# EAGLE design Zerow (EAGLE 9.1.3)

## Sheet 1 of 2

## Sheet 2 of 2
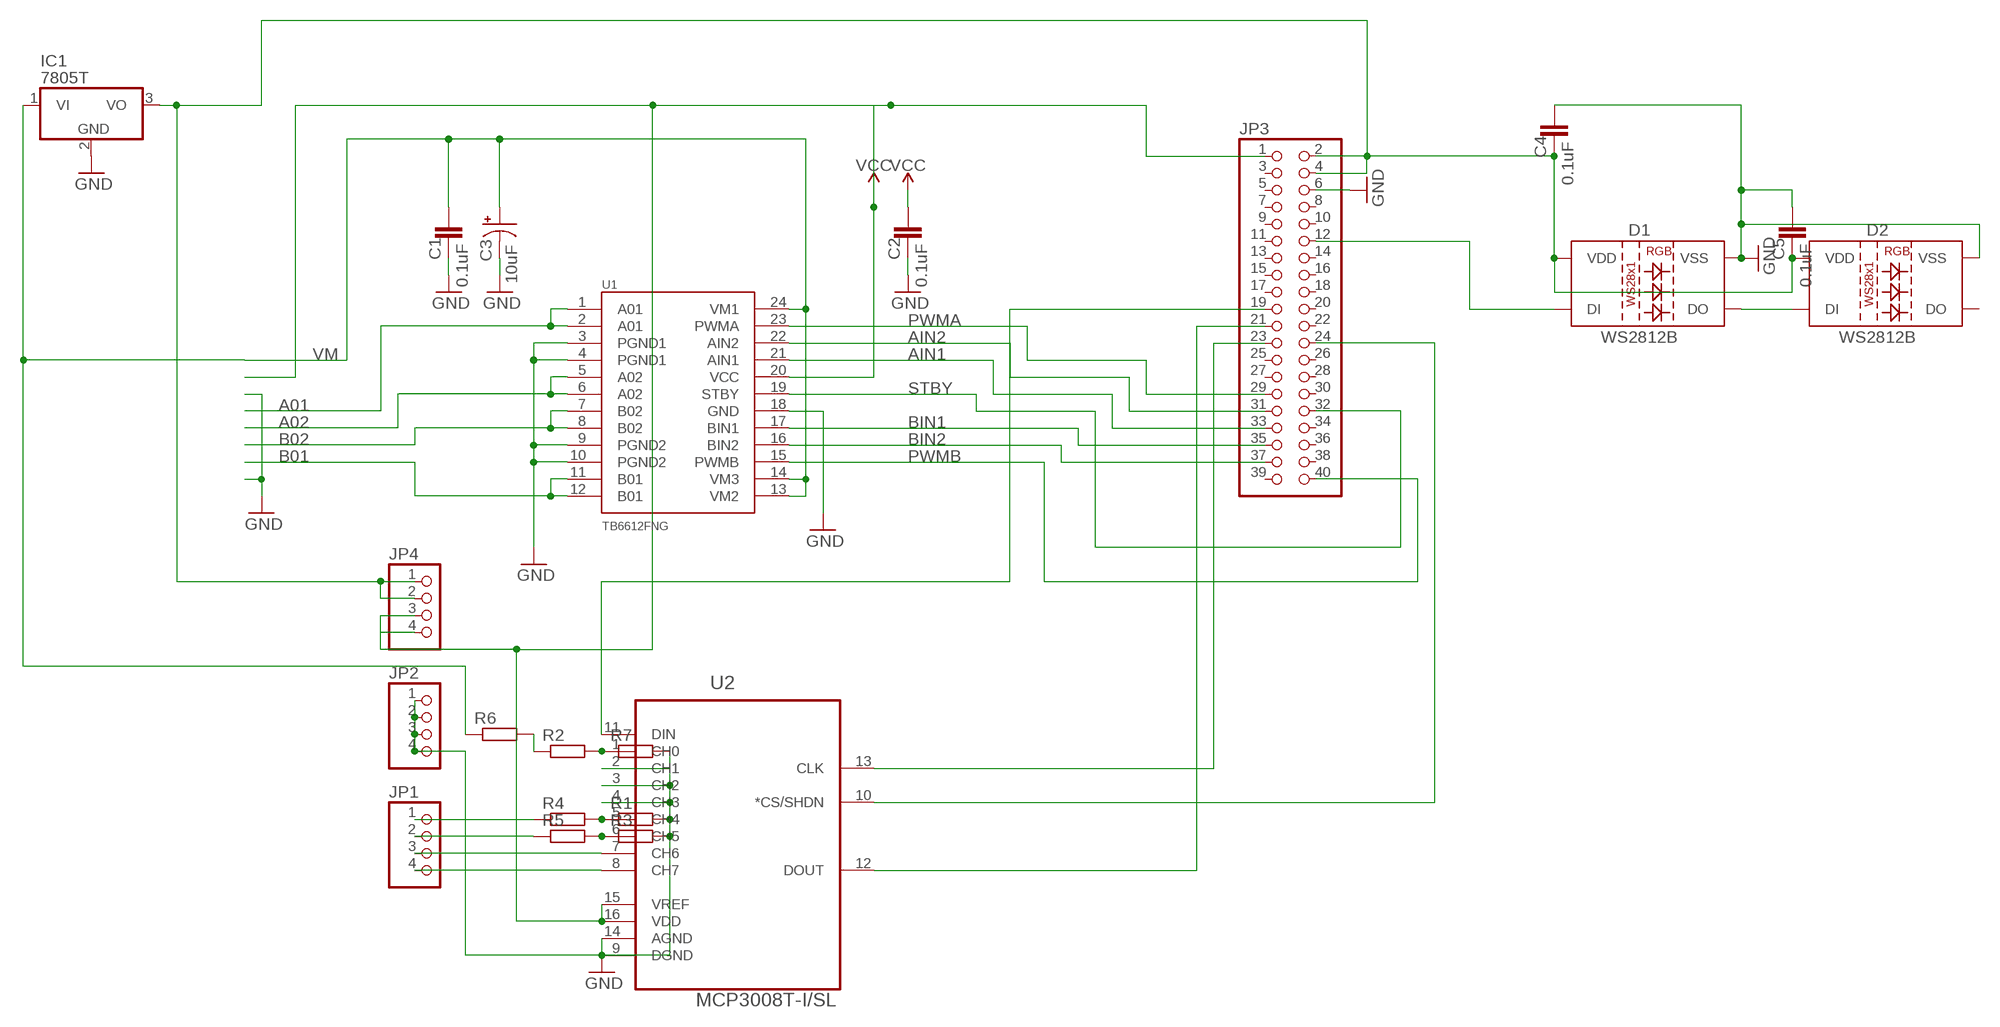
[diagram p0: schematic, sheet 2]

### Parts
C1  0.1uF  0.1UF-0402-16V-10%  [0402]
C2  0.1uF  0.1UF-0402-16V-10%  [0402]
C3  10uF  10UF-POLAR-EIA3528-20V-10%(TANT)  [EIA3528]
C4  0.1uF  0.1UF-0402-16V-10%  [0402]
C5  0.1uF  0.1UF-0402-16V-10%  [0402]
D1  WS2812B  [WS2812B]
D2  WS2812B  [WS2812B]
IC1  7805T  [TO220H]
JP1  PINHD-1X4  [1X04]
JP2  PINHD-1X4  [1X04]
JP3  PINHD-2X20  [2X20]
JP4  PINHD-1X4  [1X04]
R1  R-EU_R0805  [R0805]
R2  R-EU_R0805  [R0805]
R3  R-EU_R0805  [R0805]
R4  R-EU_R0805  [R0805]
R5  R-EU_R0805  [R0805]
R6  R-EU_R0805  [R0805]
R7  R-EU_R0805  [R0805]
U1  TB6612FNG  [SSOP24]
U2  MCP3008T-I/SL  [SOIC127P600X175-16N]

### Nets
5V: C4.2 C5.2 D1.1(VDD) D2.1(VDD) IC1.3(VO) JP3.2 JP3.4 JP4.1 JP4.2
A01: U1.1(A01) U1.2(A01)
A02: U1.5(A02) U1.6(A02)
AIN1: JP3.33 U1.21(AIN1)
AIN2: JP3.31 U1.22(AIN2)
B01: U1.11(B01) U1.12(B01)
B02: U1.7(B02) U1.8(B02)
BIN1: JP3.35 U1.17(BIN1)
BIN2: JP3.37 U1.16(BIN2)
GND: C1.2 C2.2 C3.C(-) C4.1 C5.1 D1.3(VSS) D2.3(VSS) IC1.2(GND) JP2.1 JP2.2 JP2.3 JP2.4 JP3.6 R1.2 R3.2 R7.2 U1.3(PGND1) U1.4(PGND1) U1.9(PGND2) U1.10(PGND2) U1.18(GND) U2.2(CH1) U2.3(CH2) U2.4(CH3) U2.9(DGND) U2.14(AGND)
N$3: JP3.23 U2.13(CLK)
N$4: JP3.19 U2.11(DIN)
N$5: JP3.21 U2.12(DOUT)
N$6: JP3.24 U2.10(*CS/SHDN)
N$7: JP1.4 U2.8(CH7)
N$8: JP1.3 U2.7(CH6)
N$9: R1.1 R4.2 U2.5(CH4)
N$10: R3.1 R5.2 U2.6(CH5)
N$11: JP1.1 R4.1
N$13: JP1.2 R5.1
N$14: R2.2 R7.1 U2.1(CH0)
N$15: R2.1 R6.2
N$17: D1.4(DI) JP3.12
N$18: D1.2(DO) D2.4(DI)
PWMA: JP3.29 U1.23(PWMA)
PWMB: JP3.40 U1.15(PWMB)
STBY: JP3.32 U1.19(STBY)
VCC: C2.1 JP3.1 JP4.3 JP4.4 U1.20(VCC) U2.15(VREF) U2.16(VDD)
VM: C1.1 C3.A(+) IC1.1(VI) R6.1 U1.13(VM2) U1.14(VM3) U1.24(VM1)
Unconnected: D2.2(DO) JP3.3 JP3.5 JP3.7 JP3.8 JP3.9 JP3.10 JP3.11 JP3.13 JP3.14 JP3.15 JP3.16 JP3.17 JP3.18 JP3.20 JP3.22 JP3.25 JP3.26 JP3.27 JP3.28 JP3.30 JP3.34 JP3.36 JP3.38 JP3.39

## Library data of the parts
C1 C2 C4 C5 = SparkFun-Capacitors:0.1UF: 0.1µF ceramic capacitors A capacitor is a passive two-terminal electrical component used to store electrical energy temporarily in an electric field.; PROD_ID: CAP-12416
C3 = SparkFun-Capacitors:10UF-POLAR: 10.0µF polarized capacitors A capacitor is a passive two-terminal electrical component used to store electrical energy temporarily in an electric field.; PROD_ID: CAP-08063
D1 D2 = SparkFun-LED:WS2812B: WS2812B SMD addressable RGB LED 5x5mm SMD LED with built-in controller IC. Color: Red/Green/Blue mC Rating: RGB: 390, 660, 180 mcd Forward Voltage: RGB: 2.0, 3.0, 3.0 V Packages:WS2812B SparkFun Products: Blynk Board - ESP8266 <https://www.sparkfun.com/products/13794>; PROD_ID: DIO-12503
IC1 = linear:78*: Positive VOLTAGE REGULATOR Source: http://cache.national.com/ds/LM/LM78L05.pdf http://www.fairchildsemi.com/ds/LM/LM7805.pdf
JP1 JP2 JP4 = pinhead:PINHD-1X4: PIN HEADER
JP3 = pinhead:PINHD-2X20: PIN HEADER
R1-R7 = resistor:R-EU_: RESISTOR, European symbol
U1 = SparkFun-IC-Special-Function:TB6612FNG: Toshiba 1A dual motor driver IC-09363; PROD_ID: IC-09363
U2 = MCP3008T-I_SL:MCP3008T-I/SL: 10BIT ADC, 8 CH, SPI, SMD; DESCRIPTION: Eight Channel SPI Serial Interface 2.7 V 10-Bit A/D Converter SMT - SOIC-16; DIGI-KEY_PART_NUMBER: MCP3008T-I/SLCT-ND; DIGI-KEY_PURCHASE_URL: https://www.digikey.com/product-detail/en/microchip-technology/MCP3008T-I-SL/MCP3008T-I-SLCT-ND/5148847?utm_source=snapeda&utm_medium=aggregator&utm_campaign=symbol; MF: Microchip; MP: MCP3008T-I/SL; PACKAGE: SOIC-16 Microchip

## Board
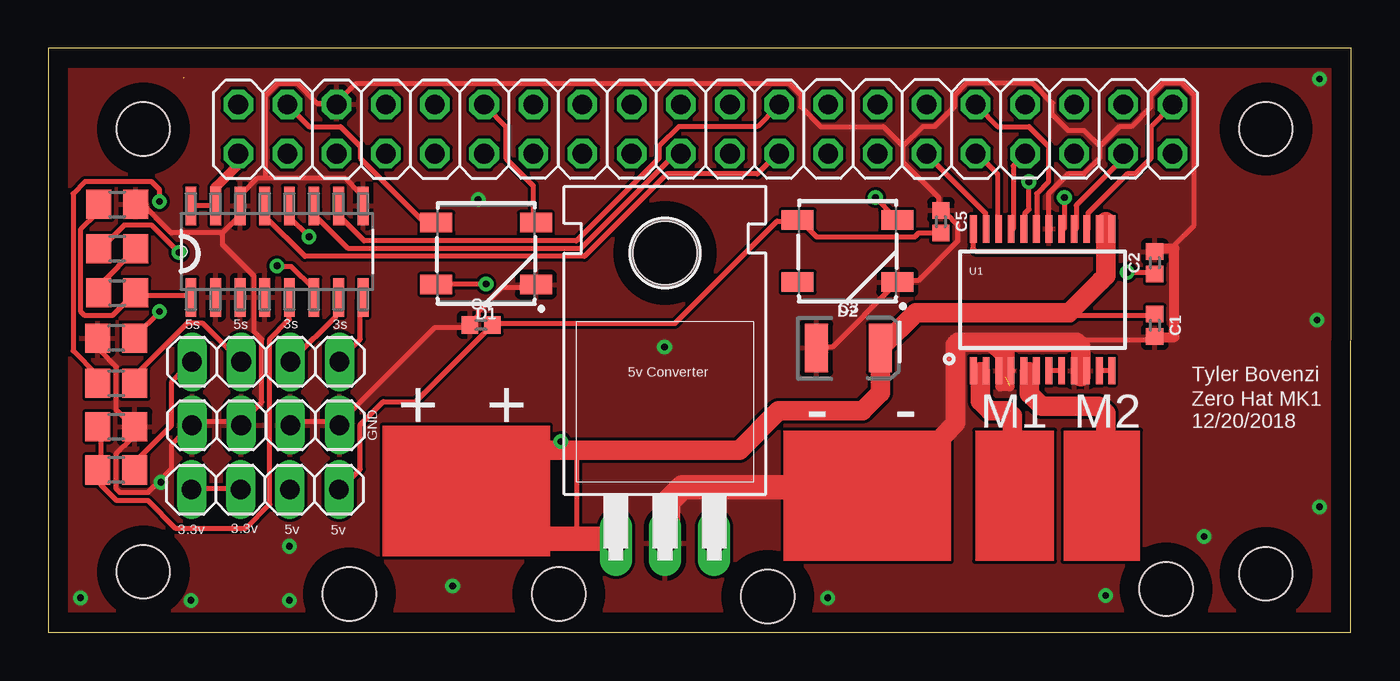
[diagram p1: board, top side]
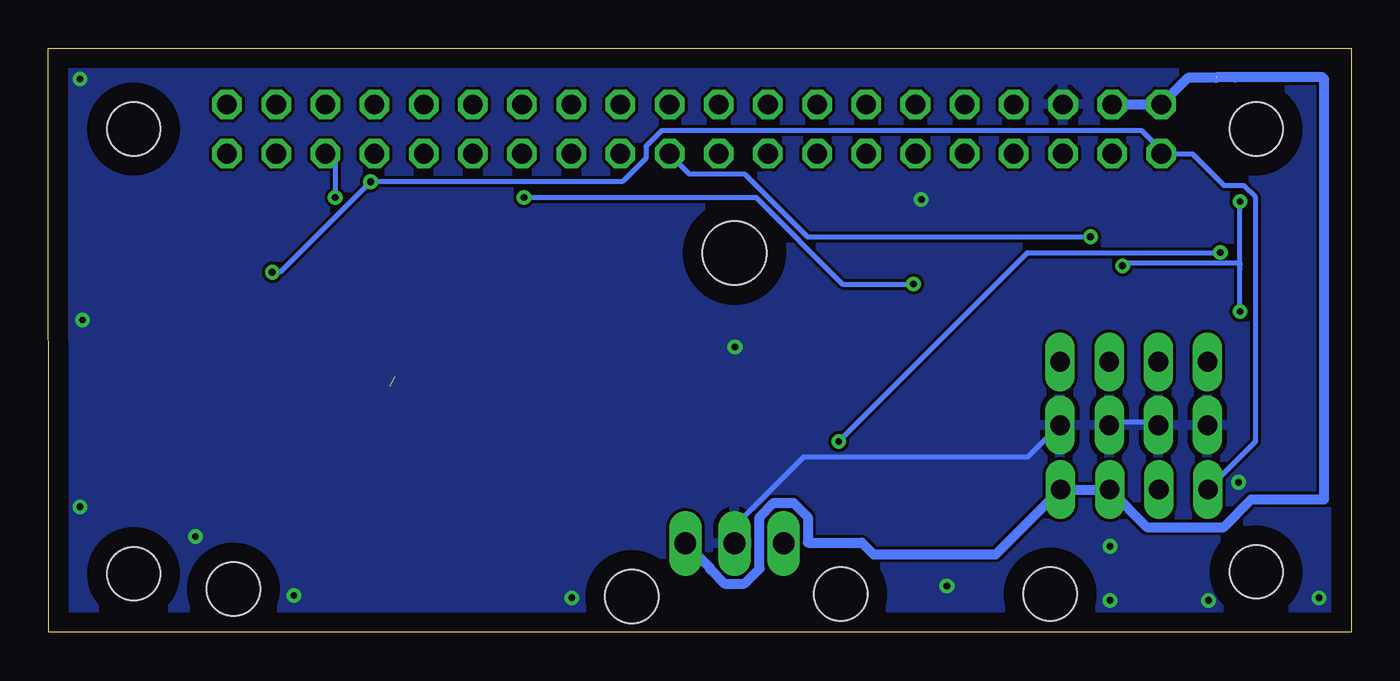
[diagram p2: board, bottom side, seen from below]

Size 67.29 x 30.15 mm. Coordinates in mm from the lower left corner, seen from the top.
Outline: 67.27,0 67.29,30.15 0,30.15 0,0 66.65,0 67.28,0
Copper layers (1*16): Top 0.035mm / dielectric 1.5mm / Bottom 0.035mm
Design rules "default *": minimum track width 10mil, minimum drill 0.35mm, track to track 6mil, track to pad 6mil, pad to pad 6mil, via to via 6mil, smd to smd 6mil, copper to edge 40mil, drill to drill 6mil, minimum pad ring 10mil, minimum via ring 8mil, stop-mask expansion 4mil, vias tented up to drill 0mil, thermal gap 10mil
Holes 2.75 mm at 4.9,25.98 4.9,3.12 62.89,3.02 62.89,25.98 15.54,1.98 26.37,1.98 37.16,1.85 57.73,2.24

### Footprints (pad centres in the part's own frame; a part is rotated, then mirrored left to right if it is on the bottom)
0402 = smd 0.85 x 0.9: 1 -0.58,0; 2 0.58,0
EIA3528 = smd 1.2 x 2.5: A 1.65,0; C -1.65,0
WS2812B = smd 1.651 x 1: 1 2.577,-1.6; 2 2.577,1.6; 3 -2.577,1.6; 4 -2.577,-1.6
TO220H = drill 1.118 long: 1 -2.54,-10.16; 2 0,-10.16; 3 2.54,-10.16 | hole 3.302: 0,4.826
1X04 = drill 1.016 long: 1 -3.81,0; 2 -1.27,0; 3 1.27,0; 4 3.81,0
2X20 = drill 1.016 octagon: 1 -24.13,-1.27; 2 -24.13,1.27; 3 -21.59,-1.27; 4 -21.59,1.27; 5 -19.05,-1.27; 6 -19.05,1.27; 7 -16.51,-1.27; 8 -16.51,1.27; 9 -13.97,-1.27; 10 -13.97,1.27; 11 -11.43,-1.27; 12 -11.43,1.27; 13 -8.89,-1.27; 14 -8.89,1.27; 15 -6.35,-1.27; 16 -6.35,1.27; 17 -3.81,-1.27; 18 -3.81,1.27; 19 -1.27,-1.27; 20 -1.27,1.27; 21 1.27,-1.27; 22 1.27,1.27; 23 3.81,-1.27; 24 3.81,1.27; 25 6.35,-1.27; 26 6.35,1.27; 27 8.89,-1.27; 28 8.89,1.27; 29 11.43,-1.27; 30 11.43,1.27; 31 13.97,-1.27; 32 13.97,1.27; 33 16.51,-1.27; 34 16.51,1.27; 35 19.05,-1.27; 36 19.05,1.27; 37 21.59,-1.27; 38 21.59,1.27; 39 24.13,-1.27; 40 24.13,1.27
R0805 = smd 1.3 x 1.5: 1 -0.95,0; 2 0.95,0
SSOP24 = smd 0.348 x 1.397: 1 -3.575,-3.656; 2 -2.925,-3.656; 3 -2.275,-3.656; 4 -1.625,-3.656; 5 -0.975,-3.656; 6 -0.325,-3.656; 7 0.325,-3.656; 8 0.975,-3.656; 9 1.625,-3.656; 10 2.275,-3.656; 11 2.925,-3.656; 12 3.575,-3.656; 13 3.575,3.656; 14 2.925,3.656; 15 2.275,3.656; 16 1.625,3.656; 17 0.975,3.656; 18 0.325,3.656; 19 -0.325,3.656; 20 -0.975,3.656; 21 -1.625,3.656; 22 -2.275,3.656; 23 -2.925,3.656; 24 -3.575,3.656
SOIC127P600X175-16N = smd 1.981 x 0.559: 1 -2.362,4.445; 2 -2.362,3.175; 3 -2.362,1.905; 4 -2.362,0.635; 5 -2.362,-0.635; 6 -2.362,-1.905; 7 -2.362,-3.175; 8 -2.362,-4.445; 9 2.362,-4.445; 10 2.362,-3.175; 11 2.362,-1.905; 12 2.362,-0.635; 13 2.362,0.635; 14 2.362,1.905; 15 2.362,3.175; 16 2.362,4.445

### Placement (x,y rotation side)
C1  57.15,15.85 270 top
C2  57.15,19.08 90 top
C3  41.33,14.68 0 top
C4  22.35,15.88 0 top
C5  46.1,21.21 270 top
D1  22.61,19.56 180 top
D2  41.28,19.69 180 top
IC1  31.85,14.76 0 top
JP1  11.23,13.97 0 top
JP2  11.23,10.69 0 top
JP3  33.93,25.98 0 top
JP4  11.2,7.37 180 top
R1  3.51,10.62 0 top
R2  3.56,17.53 0 top
R3  3.51,15.19 180 top
R4  3.51,8.38 180 top
R5  3.51,12.85 180 top
R6  3.56,19.81 0 top
R7  3.56,22.1 0 top
U1  51.36,17.17 0 top
U2  11.81,19.66 90 top

### Tracks (layer width: path | path; a pad name or v marks a point on that pad's centre or on a via)
5V  (1 unrouted)
  Top 0.254: C5.2 45.97,20.62 44.96,20.62 44.75,20.42 39.67,20.42 38.86,21.23 D2.1 38.66,21.23 37.64,21.23 32.36,15.95 23.01,15.95 C4.2 18.97,11.91 17.29,11.91 16.1,10.72 16.1,8.43 15.09,7.42 JP4.1 | D1.1 19.96,21.23 19.36,21.23 16.1,24.49 16.1,25.09 15.09,26.11 13.46,26.11 12.45,27.13 JP3.4
  Bottom 0.508: IC1.3 33.1,3.3 33.1,3.24 32.37,2.52 31.34,2.52 30.56,3.29 30.56,5.95 29.83,6.68 28.8,6.68 28.07,5.95 28.07,4.63 25.27,4.63 24.66,4.02 18.36,4.02 JP4.1 JP4.2 | JP4.2 12.35,7.37 | JP3.4 JP3.2 8.43,28.63 6.98,28.63 | JP4.2 10.54,5.44 6.59,5.44 5.16,6.86 1.4,6.86 1.4,28.57 1.49,28.66 5.99,28.66 6,28.65 6.96,28.65
A01
  Top 0.254: U1.1 47.8,13.51 48.13,13.46 48.41,13.51 U1.2
  Top 1.016: 48.13,13.46 48.13,11.94 48.64,11.43 49.53,11.43 49.78,11.18 49.78,9.78
A02
  Top 0.254: U1.5 50.44,13.51 50.67,13.46 51.05,13.51 U1.6
  Top 1.016: 50.67,13.46 50.67,12.32 51.31,11.68 54.23,11.68 54.61,11.3 54.61,10.16
AIN1
  Top 0.254: U1.21 49.84,20.83 49.84,24.08 50.44,24.69 JP3.33
AIN2
  Top 0.254: U1.22 49.02,20.83 49.02,23.67 48.01,24.69 JP3.31
B01
  Top 0.254: U1.11 54.31,13.51 54.92,13.51 U1.12
B02
  Top 0.254: U1.7 51.66,13.51 52.27,13.51 U1.8
BIN1  (via drill 0.35)
  Top 0.254: v52.48,22.45 52.48,20.83 U1.17
  Bottom 0.254: v52.48,22.45 52.48,24.28 52.88,24.69 JP3.35
BIN2
  Top 0.254: U1.16 53.09,20.83 53.09,22.05 55.52,24.49 55.52,24.69 JP3.37
GND  (via drill 0.35)  (1 unrouted)
  Top 0.254: 53.09,15.11 53.49,15.11 | 53.49,15.11 57.15,15.11 57.15,15.14 C1.2 | C3.C 39.88,14.73 40.49,14.73 43.74,17.98 D2.3 43.94,18.19 44.96,18.19 46.99,20.22 46.99,21.03 46.38,21.64 46.18,21.64 C5.1 45.97,21.84 45.97,22.45 44.14,24.28 44.14,25.09 | C1.2 57.15,15.34 C1.2 | C1.2 57.15,15.24 | 53.49,15.11 53.49,15.14 53.09,14.99 | C2.2 57.15,19.61 57.15,19.81 | U1.3 49.23,13.51 49.4,13.51 49.84,13.51 U1.4 | U1.9 53.09,13.51 53.34,13.51 53.7,13.51 U1.10 | 54.31,25.09 54.31,24.49 53.49,23.67 52.68,23.67 51.66,22.66 51.66,20.83 U1.18 | 54.31,25.09 55.32,26.11 55.93,26.11 56.95,27.13 56.95,27.74 57.56,28.35 58.57,28.35 59.18,27.74 59.18,21.03 58.17,20.02 58.17,19.81 | 44.14,25.09 45.16,26.11 45.77,26.11 46.79,27.13 46.79,27.74 47.4,28.35 50.85,28.35 51.87,27.33 51.87,26.72 52.68,25.91 53.49,25.91 54.31,25.09 | 8.99,20.62 6.35,20.62 4.93,22.05 4.52,22.05 R7.2 | 8.99,20.62 9.8,21.44 9.8,21.84 U2.14 10.01,22.05 10.01,22.66 10.82,23.47 11.23,23.47 | 11.23,23.47 15.29,23.47 16.1,22.66 16.1,22.05 U2.9 | 14.88,27.33 13.87,27.33 12.85,28.35 11.84,28.35 11.23,27.74 11.23,23.47 | 14.88,27.33 JP3.6 14.88,27.33 | R3.2 2.69,15.14 2.69,14.53 3.5,13.72 3.5,11.48 4.32,10.67 R1.2 4.32,10.47 4.32,10.06 3.5,9.25 3.5,7.42 3.71,7.21 5.13,7.21 6.35,8.43 6.35,9.65 7.37,10.67 JP2.1 7.57,10.87 9.8,10.87 JP2.2 10.01,10.87 11.02,11.89 11.02,15.14 10.62,15.55 10.62,18.39 8.99,20.02 8.99,20.62 | IC1.2 31.95,4.57 32,4.57 | D1.3 25.04,17.78 23.42,17.78 22.2,16.56 22.2,16.36 21.79,15.95 C4.1 21.59,15.75 19.96,15.75 15.09,10.87 JP2.4 14.88,10.87 12.65,10.87 JP2.3 | 44.14,25.09 43.13,26.11 39.88,26.11 38.86,27.13 38.86,27.74 38.25,28.35 15.9,28.35 14.88,27.33
  Top 0.508: 57.15,15.24 58.17,15.24 58.17,19.81 57.15,19.81 | 49.66,12.7 49.15,12.7
  Top 1.016: 46.23,10.16 46.86,10.8 46.86,14.1 46.86,14.86 46.99,14.99 48.77,14.99 | 48.77,14.99 49.4,14.35 49.4,13.51 49.4,13.21 | 48.77,14.99 53.09,14.99 53.21,14.86 53.34,14.73 53.34,13.51 53.34,13.21
  Top 1.27: 32,4.57 32,6.73 32.13,6.86 32.77,7.49 38.35,7.49
  Bottom 0.254: IC1.2 31.75,4.78 31.75,5.59 28.3,9.04 16.71,9.04 15.09,10.67 JP2.4 | JP2.2 10.01,10.87 12.45,10.87 JP2.3
  other vias: 1.65,1.78 7.37,1.65 12.45,1.65 12.45,4.45 40.26,1.78 65.66,28.58 65.53,16.13 65.66,6.48 59.69,4.95 54.61,1.91 20.88,2.39 31.83,14.73 22.2,22.35 5.82,7.75
  pour Top: 0.25,0.25 67.06,0.25 67.06,29.84 0.25,29.84
  pour Bottom: 0.13,30.1 67.18,30.1 67.18,0.51 0.13,0.51
N$3
  Top 0.254: U2.13 11.23,21.84 11.23,21.44 13.26,19.41 27.69,19.41 31.95,23.67 36.63,23.67 37.64,24.69 JP3.23
N$4
  Top 0.254: U2.11 13.87,21.84 13.87,21.44 15.49,19.81 27.48,19.81 32.56,24.89 JP3.19
N$5  (via drill 0.35)
  Top 0.254: v13.46,20.42 12.45,21.44 12.45,21.84 U2.12
  Bottom 0.254: v13.46,20.42 28.09,20.42 31.34,23.67 34.19,23.67 35.2,24.69 JP3.21
N$6
  Top 0.254: U2.10 15.09,21.84 15.09,21.44 16.31,20.22 27.28,20.22 31.55,24.49 31.55,25.09 32.56,26.11 36.63,26.11 37.64,27.13 JP3.24
N$7
  Top 0.254: U2.8 16.1,17.17 16.1,15.14 15.09,14.12 JP1.4
N$8
  Top 0.254: U2.7 14.88,17.17 14.88,16.36 12.65,14.12 JP1.3
N$9
  Top 0.254: R1.1 2.69,10.47 2.69,8.43 R4.2 2.69,8.23 2.69,7.62 3.5,6.81 5.13,6.81 6.55,5.39 10.21,5.39 11.43,6.6 11.43,15.14 12.45,16.15 12.45,17.17 U2.5
N$10  (via drill 0.35)
  Top 0.254: v5.74,22.25 5.74,22.86 5.33,23.27 1.88,23.27 1.27,22.66 1.27,14.53 2.49,13.31 2.49,12.9 R5.2 | v5.74,16.56 4.52,15.34 R3.1 | U2.6 13.67,17.37 13.67,17.78 12.55,18.9 11.84,18.9 v11.81,18.92
  Bottom 0.254: v5.74,16.56 5.74,18.8 5.74,18.97 5.74,19.05 | 5.74,19.05 v5.74,22.25 | 5.74,19.05 11.86,19.05 11.86,18.97 v11.81,18.92
N$11
  Top 0.254: R4.1 4.52,8.43 4.52,8.84 6.35,10.67 6.35,12.9 7.37,13.92 JP1.1
N$13
  Top 0.254: R5.1 4.52,12.9 4.52,13.31 7.16,15.95 7.98,15.95 9.8,14.12 JP1.2
N$14
  Top 0.254: U2.1 7.37,17.37 4.52,17.37 R2.2 4.32,17.37 3.3,16.36 1.88,16.36 1.68,16.56 1.68,20.83 2.49,21.64 2.49,22.05 R7.1
N$15
  Top 0.254: R2.1 2.69,17.58 2.69,17.98 4.52,19.81 R6.2
N$17
  Top 0.254: D1.4 25.04,21.23 25.04,23.06 23.62,24.49 23.62,26.11 22.61,27.13 JP3.12
N$18  (via drill 0.35)
  Top 0.254: v22.61,17.98 20.17,17.98 D1.2 | v42.72,22.45 43.74,21.44 D2.4
  Bottom 0.254: v22.61,17.98 26.26,17.98 30.73,22.45 v42.72,22.45
PWMA
  Top 0.254: U1.23 48.41,20.83 48.41,21.64 45.36,24.69 JP3.29
PWMB
  Top 0.254: U1.15 53.7,20.83 53.7,21.64 55.73,23.67 56.13,23.67 56.95,24.49 56.95,26.11 57.96,27.13 JP3.40
STBY
  Top 0.254: U1.19 51.05,20.83 51.05,22.66 51.66,23.27 51.66,25.09 50.65,26.11 49.02,26.11 48.01,27.13 JP3.32
VCC  (via drill 0.35)
  Top 0.254: U2.16 U2.15 8.59,22.05 8.59,22.86 8.64,22.99 | v55.73,18.59 57.15,18.59 C2.1 | v50.65,23.27 50.65,21.84 50.44,21.64 50.44,20.83 U1.20 | 9.78,24.64 9.8,24.69 JP3.1 | JP4.4 7.57,7.42 9.8,7.42 JP4.3
  Top 0.508: 9.78,24.64 9.78,24.13 8.64,22.99
  Bottom 0.254: v55.73,18.59 55.32,18.59 v50.65,23.27 37.64,23.27 36.42,24.49 36.42,25.09 35.61,25.91 10.82,25.91 9.8,24.89 JP3.1 9.8,24.69 8.18,24.69 6.55,23.06 5.54,23.06 4.93,22.45 4.93,9.86 7.37,7.42 JP4.4
VM  (via drill 0.35)
  Top 0.254: 54.31,19.69 47.88,19.69 47.75,19.81 47.75,20.32 47.8,20.42 47.8,20.62 U1.24 | 54.31,19.69 54.36,19.69 | 52.83,16.13 53.09,16.38 | 53.09,16.38 57.15,16.38 | 57.15,16.38 57.28,16.38 | 29.08,4.83 29.31,4.78 IC1.1 | 57.15,16.38 57.15,16.36 57.15,16.38 | 57.15,16.38 C1.1 | 53.09,16.38 53.09,16.36 52.7,16.51 | 54.31,19.69 54.31,19.61 54.61,19.61 | U1.14 54.31,20.83 54.61,20.83 54.92,20.83 U1.13 | v6.76,19.61 5.33,21.03 3.91,21.03 2.69,19.81 R6.1 | v26.47,9.86 26.47,9.4 | 27.28,4.83 27.28,5.39 27.28,9.04 27.28,9.4
  Top 1.016: 54.61,21.21 54.61,20.83 54.61,19.61 54.61,18.41 54.36,18.16 52.7,16.51 44.8,16.51 C3.A 42.98,12.37 42.04,11.43 37.72,11.43 35.69,9.4 27.28,9.4 26.47,9.4 25.4,9.4
  Top 1.27: 25.27,4.83 27.28,4.83 29.08,4.83 29.21,4.7
  Bottom 0.254: v6.76,19.61 16.71,19.61 v26.47,9.86
(copper drawn outside any net)
  shapes: Top area x4

### Text on the board
tPlace: 5v Converter
tNames: 5s | 5s | 3s | 3s | Tyler Bovenzi | Zero Hat MK1 | GND | + | + | - | - | M1 | M2 | 12/20/2018 | 3.3v | 3.3v | 5v | 5v